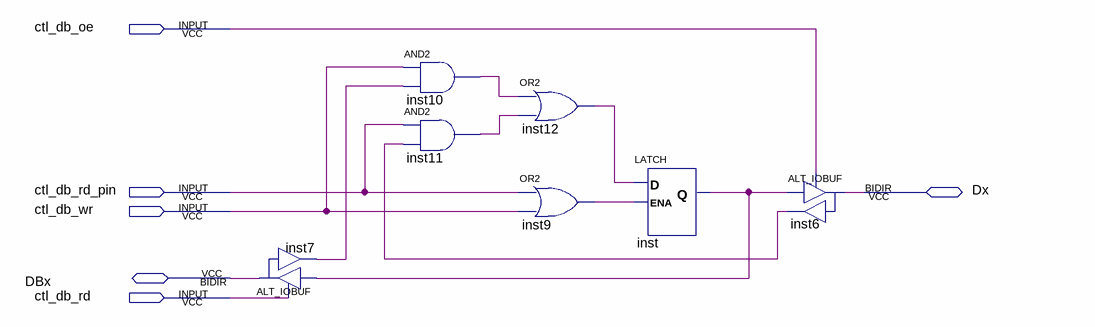
[diagram p0: schematic sheet]
// Quartus schematic datapin.bdf as structural Verilog: 7 symbols, 6 pins
module datapin (
  input  ctl_db_oe,
  input  ctl_db_rd_pin,
  input  ctl_db_wr,
  input  ctl_db_rd,
  inout  Dx,
  inout  DBx
);

  wire inst6_o, inst7_o, inst9_out, inst10_out, inst11_out, inst12_out, inst_q;

  ALT_IOBUF inst7 (.i(inst_q), .oe(ctl_db_rd), .o(inst7_o), .io(DBx));
  and inst10 (inst10_out, ctl_db_wr, inst7_o);
  and inst11 (inst11_out, ctl_db_rd_pin, inst6_o);
  or inst12 (inst12_out, inst10_out, inst11_out);
  or inst9 (inst9_out, ctl_db_rd_pin, ctl_db_wr);
  LATCH inst (.D(inst12_out), .ENA(inst9_out), .Q(inst_q));
  ALT_IOBUF inst6 (.i(inst_q), .oe(ctl_db_oe), .o(inst6_o), .io(Dx));
endmodule
